# EAGLE design IPSv1.0 (EAGLE 9.5.0)
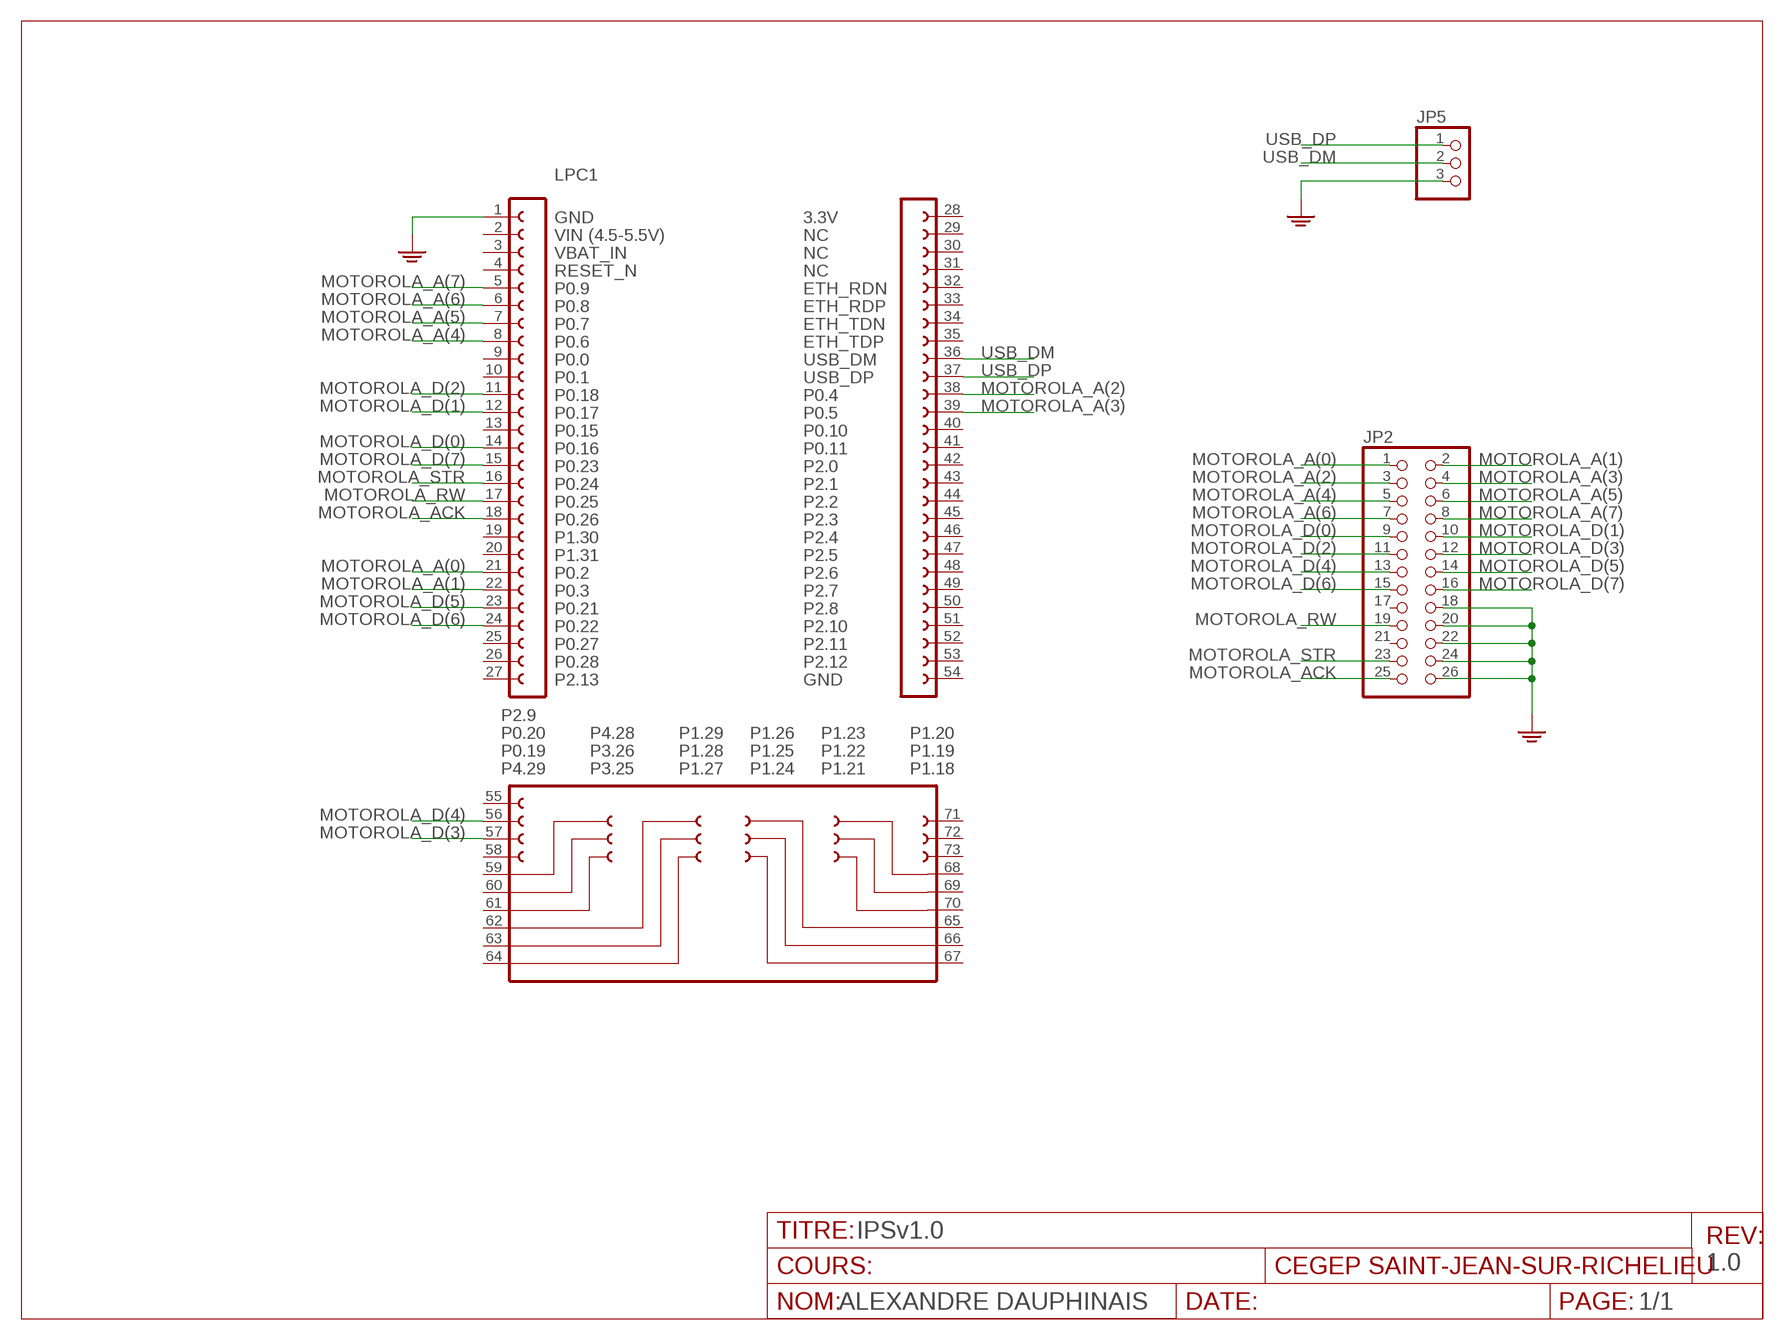
[diagram p0: schematic, sheet 1]

## Parts
JP2  PINHD-2X13  [2X13]
JP5  PINHD-1X3  [1X03]
LPC1  LPCXPRESSO_LPC1769  [LPCXPRESSO_LPC1769]

## Nets
GND: JP2.18 JP2.20 JP2.22 JP2.24 JP2.26 JP5.3 LPC1.1
MOTOROLA_A(0): JP2.1 LPC1.21
MOTOROLA_A(1): JP2.2 LPC1.22
MOTOROLA_A(2): JP2.3 LPC1.38
MOTOROLA_A(3): JP2.4 LPC1.39
MOTOROLA_A(4): JP2.5 LPC1.8
MOTOROLA_A(5): JP2.6 LPC1.7
MOTOROLA_A(6): JP2.7 LPC1.6
MOTOROLA_A(7): JP2.8 LPC1.5
MOTOROLA_ACK: JP2.25 LPC1.18
MOTOROLA_D(0): JP2.9 LPC1.14
MOTOROLA_D(1): JP2.10 LPC1.12
MOTOROLA_D(2): JP2.11 LPC1.11
MOTOROLA_D(3): JP2.12 LPC1.57
MOTOROLA_D(4): JP2.13 LPC1.56
MOTOROLA_D(5): JP2.14 LPC1.23
MOTOROLA_D(6): JP2.15 LPC1.24
MOTOROLA_D(7): JP2.16 LPC1.15
MOTOROLA_RW: JP2.19 LPC1.17
MOTOROLA_STR: JP2.23 LPC1.16
USB_DM: JP5.2 LPC1.36
USB_DP: JP5.1 LPC1.37
Unconnected: JP2.17 JP2.21 LPC1.2 LPC1.3 LPC1.4 LPC1.9 LPC1.10 LPC1.13 LPC1.19 LPC1.20 LPC1.25 LPC1.26 LPC1.27 LPC1.28 LPC1.29 LPC1.30 LPC1.31 LPC1.32 LPC1.33 LPC1.34 LPC1.35 LPC1.40 LPC1.41 LPC1.42 LPC1.43 LPC1.44 LPC1.45 LPC1.46 LPC1.47 LPC1.48 LPC1.49 LPC1.50 LPC1.51 LPC1.52 LPC1.53 LPC1.54 LPC1.55 LPC1.58 LPC1.59 LPC1.60 LPC1.61 LPC1.62 LPC1.63 LPC1.64 LPC1.65 LPC1.66 LPC1.67 LPC1.68 LPC1.69 LPC1.70 LPC1.71 LPC1.72 LPC1.73

## Library data of the parts
JP2 = pinhead:PINHD-2X13: PIN HEADER
JP5 = pinhead:PINHD-1X3: PIN HEADER
LPC1 = LPCXpresso_boards:LPCXPRESSO_LPC1769

## Board
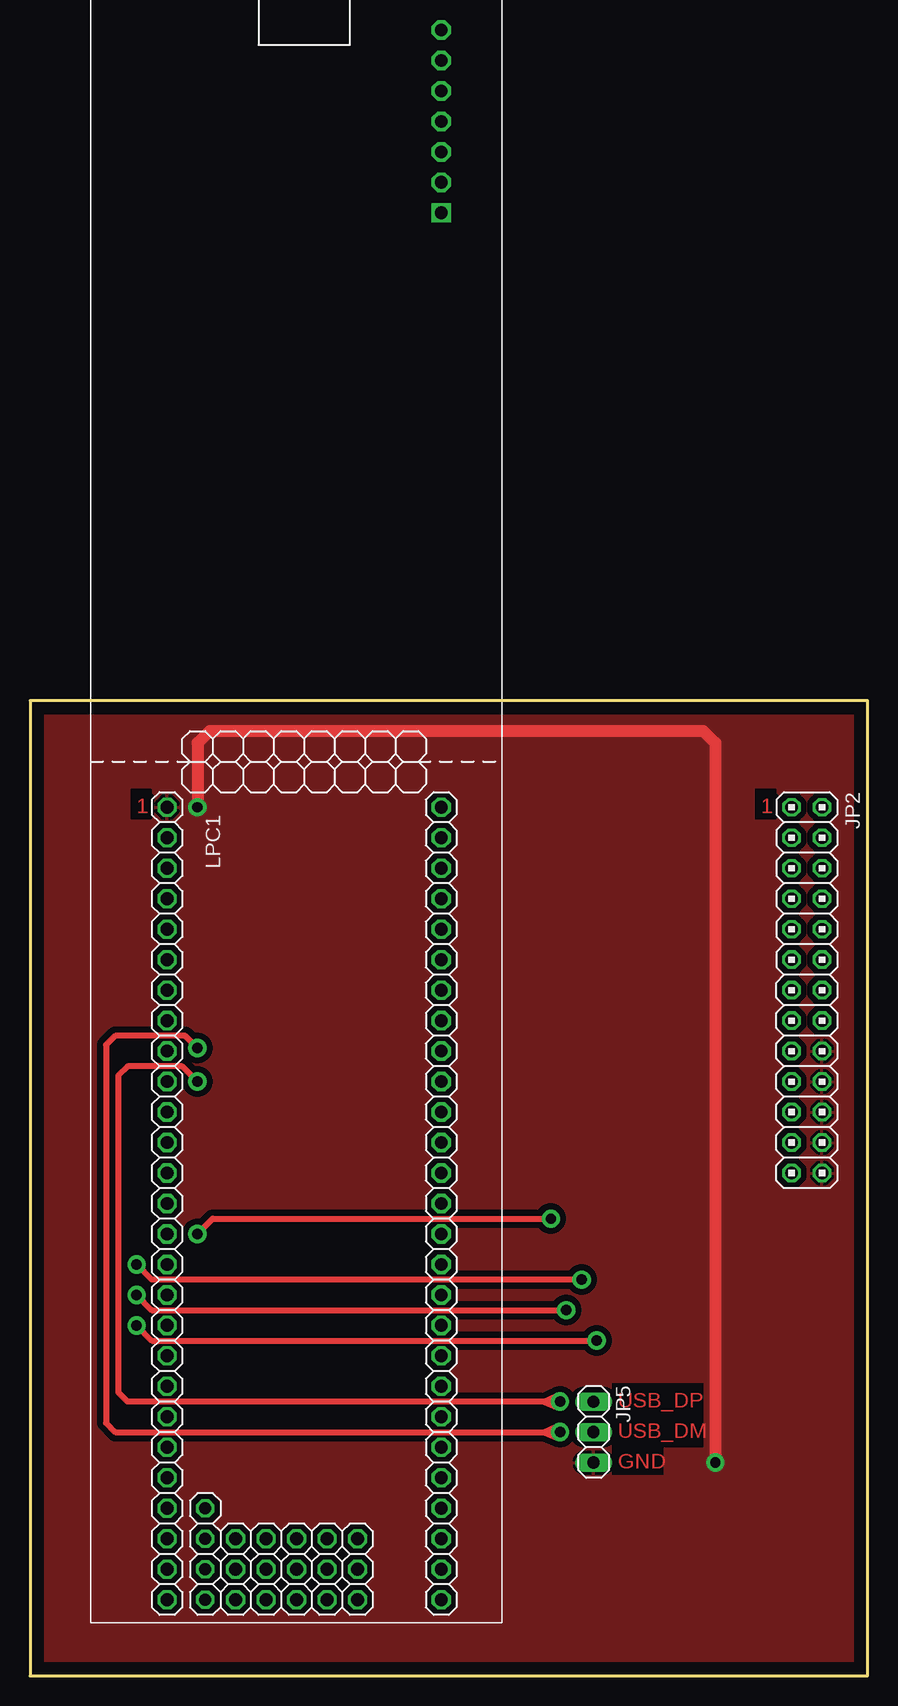
[diagram p1: board, top side]
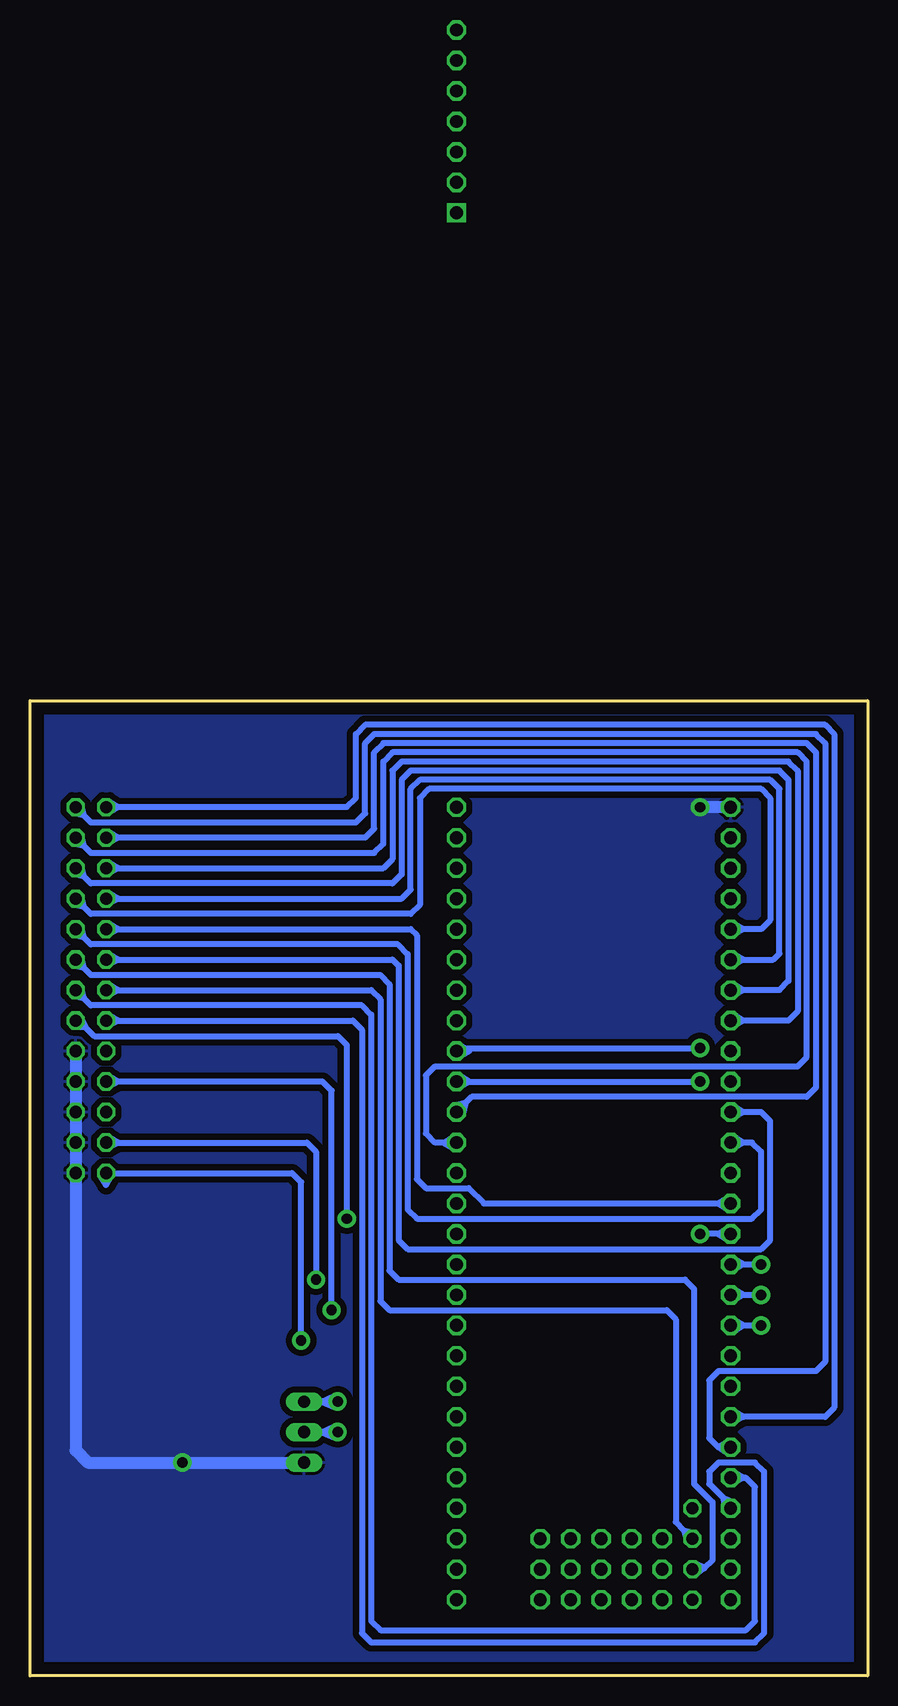
[diagram p2: board, bottom side, seen from below]

Size 69.85 x 81.28 mm. Coordinates in mm from the lower left corner, seen from the top.
Outline: 0,0 69.85,0 69.85,81.28 0,81.28 0,0
Copper layers (1*16): Top 0.035mm / dielectric 1.5mm / Bottom 0.035mm
Design rules "DRCmasse": minimum track width 20mil, minimum drill 1mil, track to track 20mil, track to pad 50mil, pad to pad 10mil, via to via 10mil, smd to smd 8mil, copper to edge 40mil, drill to drill 8mil, minimum pad ring 10mil, minimum via ring 8mil, stop-mask expansion 0mil, vias tented up to drill 0mil, thermal gap 10mil
tRestrict: area 48.5,19 to 56.1,24.4; area 48.5,16.8 to 52.8,19.1; area 8.4,71.4 to 10.2,73.9; area 60.5,71.4 to 62.2,73.9

### Footprints (pad centres in the part's own frame; a part is rotated, then mirrored left to right if it is on the bottom)
2X13 = drill 1.016 octagon: 1 -15.24,-1.27; 2 -15.24,1.27; 3 -12.7,-1.27; 4 -12.7,1.27; 5 -10.16,-1.27; 6 -10.16,1.27; 7 -7.62,-1.27; 8 -7.62,1.27; 9 -5.08,-1.27; 10 -5.08,1.27; 11 -2.54,-1.27; 12 -2.54,1.27; 13 0,-1.27; 14 0,1.27; 15 2.54,-1.27; 16 2.54,1.27; 17 5.08,-1.27; 18 5.08,1.27; 19 7.62,-1.27; 20 7.62,1.27; 21 10.16,-1.27; 22 10.16,1.27; 23 12.7,-1.27; 24 12.7,1.27; 25 15.24,-1.27; 26 15.24,1.27
1X03 = drill 1.016 long: 1 -2.54,0; 2 0,0; 3 2.54,0
LPCXPRESSO_LPC1769 = drill 1.067 octagon: 1 33.655,-5.715; 2 36.195,-5.715; 3 38.735,-5.715; 4 41.275,-5.715; 5 43.815,-5.715; 6 46.355,-5.715; 7 48.895,-5.715; 8 51.435,-5.715; 9 53.975,-5.715; 10 56.515,-5.715; 11 59.055,-5.715; 12 61.595,-5.715; 13 64.135,-5.715; 14 66.675,-5.715; 15 69.215,-5.715; 16 71.755,-5.715; 17 74.295,-5.715; 18 76.835,-5.715; 19 79.375,-5.715; 20 81.915,-5.715; 21 84.455,-5.715; 22 86.995,-5.715; 23 89.535,-5.715; 24 92.075,-5.715; 25 94.615,-5.715; 26 97.155,-5.715; 27 99.695,-5.715; 28 33.655,17.145; 29 36.195,17.145; 30 38.735,17.145; 31 41.275,17.145; 32 43.815,17.145; 33 46.355,17.145; 34 48.895,17.145; 35 51.435,17.145; 36 53.975,17.145; 37 56.515,17.145; 38 59.055,17.145; 39 61.595,17.145; 40 64.135,17.145; 41 66.675,17.145; 42 69.215,17.145; 43 71.755,17.145; 44 74.295,17.145; 45 76.835,17.145; 46 79.375,17.145; 47 81.915,17.145; 48 84.455,17.145; 49 86.995,17.145; 50 89.535,17.145; 51 92.075,17.145; 52 94.615,17.145; 53 97.155,17.145; 54 99.695,17.145; 59 94.615,0; 60 97.155,0; 61 99.695,0; 62 94.615,2.54; 63 97.155,2.54; 64 99.695,2.54; 65 94.615,5.08; 66 97.155,5.08; 67 99.695,5.08; 68 94.615,7.62; 69 97.155,7.62; 70 99.695,7.62; 71 94.615,10.16; 72 97.155,10.16; 73 99.695,10.16; P$1 -31.115,17.145; P$2 -28.575,17.145; P$3 -26.035,17.145; P$4 -23.495,17.145; P$5 -20.955,17.145; P$6 -18.415,17.145 | drill 1 octagon: 55 92.075,-2.54; 56 94.615,-2.54; 57 97.155,-2.54; 58 99.695,-2.54 | drill 1.067 square: P$7 -15.875,17.145

### Placement (x,y rotation side)
JP2  64.77,57.15 270 top
JP5  46.99,20.32 270 top
LPC1  17.14,106.05 270 top

### Tracks (layer width: path | path; a pad name or v marks a point on that pad's centre or on a via)
GND  (via drill 0.86 pad 1.52)
  Top 1.016: v57.15,17.78 57.15,77.72 56.13,78.74 14.99,78.74 13.97,77.72 v13.97,72.39
  Bottom 1.016: JP2.18 JP2.20 JP2.22 JP2.24 JP2.26 66.04,18.8 65.02,17.78 v57.15,17.78 JP5.3 | LPC1.1 v13.97,72.39
  pour Top: 0,0 69.85,0 69.85,81.28 0,81.28
  pour Bottom: 0,0 69.85,0 69.85,81.28 0,81.28
MOTOROLA_A(0)
  Bottom 0.508: 62.48,72.39 43.43,72.39 42.67,73.15 42.67,78.49 41.91,79.25 3.56,79.25 2.79,78.49 2.79,22.35 3.56,21.59 10.36,21.59 | 62.48,72.39 JP2.1 | 10.36,21.59 | 10.36,21.59 LPC1.21 | 62.48,72.39 | 62.48,72.39 63.25,71.95 | JP2.1 63.25,71.95 | 62.48,72.39 | 62.48,72.39 63.25,72.83 | JP2.1 63.25,72.83 | 62.48,72.39 63.25,71.95 | 63.25,71.95 | JP2.1 63.25,71.95 | 62.48,72.39 63.25,72.83 | JP2.1 63.25,72.83 | 62.48,72.39 63.25,71.95 | JP2.1 63.25,71.95 | 62.48,72.39 63.25,72.83 | JP2.1 63.25,72.83 | 10.36,21.59 | 10.36,21.59 11.15,21.12 | LPC1.21 11.15,21.12 | 10.36,21.59 11.15,22.06 | LPC1.21 11.15,22.06 | 10.36,21.59 11.15,21.12 | 10.36,21.59 11.15,22.06 | 10.36,21.59 11.15,21.12 | LPC1.21 11.15,21.12 | 10.36,21.59 11.15,22.06 | LPC1.21 11.15,22.06
MOTOROLA_A(1)
  Bottom 0.508: JP2.2 65.32,71.67 | 65.32,71.67 64.77,71.12 42.67,71.12 41.91,71.88 41.91,77.72 41.15,78.49 4.32,78.49 3.56,77.72 3.56,26.16 4.32,25.4 12.45,25.4 13.21,24.64 13.21,19.81 12.5,19.1 | LPC1.22 12.45,19.05 12.5,19.1 | 12.5,19.1 11.69,19.53 LPC1.22 | 12.5,19.1 11.73,18.59 LPC1.22 | 65.32,71.67 66.17,71.9 JP2.2 | 65.32,71.67 65.55,72.52 JP2.2
MOTOROLA_A(2)
  Bottom 0.508: JP2.3 62.48,69.85 | 33.54,47.74 33.02,48.26 5.08,48.26 4.32,49.02 4.32,76.96 5.08,77.72 40.39,77.72 41.15,76.96 41.15,70.61 41.91,69.85 62.48,69.85 | 33.54,47.74 | 33.54,47.74 LPC1.38 | 62.48,69.85 | 62.48,69.85 63.25,69.41 | JP2.3 63.25,69.41 | 62.48,69.85 | 62.48,69.85 63.25,70.29 | JP2.3 63.25,70.29 | 62.48,69.85 63.25,69.41 | 63.25,69.41 | JP2.3 63.25,69.41 | 62.48,69.85 63.25,70.29 | JP2.3 63.25,70.29 | 62.48,69.85 63.25,69.41 | JP2.3 63.25,69.41 | 62.48,69.85 63.25,70.29 | JP2.3 63.25,70.29 | 33.54,47.74 | 33.54,47.74 33.76,46.86 | 33.76,46.86 | 33.54,47.74 34.42,47.52 | 34.42,47.52 | 33.54,47.74 33.76,46.86 | 33.76,46.86 | LPC1.38 33.76,46.86 | 33.54,47.74 | 33.54,47.74 34.42,47.52 | LPC1.38 34.42,47.52 | 33.54,47.74 33.76,46.86 | LPC1.38 33.76,46.86 | 33.54,47.74 34.42,47.52 | LPC1.38 34.42,47.52
MOTOROLA_A(3)
  Bottom 0.508: JP2.4 65.32,69.13 | 65.32,69.13 64.77,68.58 41.15,68.58 40.39,69.34 40.39,76.2 39.62,76.96 5.84,76.96 5.08,76.2 5.08,51.56 5.84,50.8 36.07,50.8 36.83,50.04 36.83,45.21 36.07,44.45 35.36,44.45 | LPC1.39 35.36,44.45 | 35.36,44.45 | 35.36,44.45 34.57,44.92 | LPC1.39 34.57,44.92 | 35.36,44.45 | 35.36,44.45 34.57,43.98 | LPC1.39 34.57,43.98 | 35.36,44.45 34.57,44.92 | 35.36,44.45 34.57,43.98 | 35.36,44.45 34.57,44.92 | LPC1.39 34.57,44.92 | 35.36,44.45 34.57,43.98 | LPC1.39 34.57,43.98 | 65.32,69.13 66.17,69.36 JP2.4 | 65.32,69.13 65.55,69.98 JP2.4
MOTOROLA_A(4)
  Bottom 0.508: JP2.5 62.48,67.31 | 10.36,54.61 6.6,54.61 5.84,55.37 5.84,75.44 6.6,76.2 38.86,76.2 39.62,75.44 39.62,68.07 40.39,67.31 62.48,67.31 | 10.36,54.61 | 10.36,54.61 LPC1.8 | 62.48,67.31 | 62.48,67.31 63.25,66.87 | JP2.5 63.25,66.87 | 62.48,67.31 | 62.48,67.31 63.25,67.75 | JP2.5 63.25,67.75 | 62.48,67.31 63.25,66.87 | 63.25,66.87 | JP2.5 63.25,66.87 | 62.48,67.31 63.25,67.75 | JP2.5 63.25,67.75 | 62.48,67.31 63.25,66.87 | JP2.5 63.25,66.87 | 62.48,67.31 63.25,67.75 | JP2.5 63.25,67.75 | 10.36,54.61 | 10.36,54.61 11.15,54.14 | LPC1.8 11.15,54.14 | 10.36,54.61 11.15,55.08 | LPC1.8 11.15,55.08 | 10.36,54.61 11.15,54.14 | 10.36,54.61 11.15,55.08 | 10.36,54.61 11.15,54.14 | LPC1.8 11.15,54.14 | 10.36,54.61 11.15,55.08 | LPC1.8 11.15,55.08
MOTOROLA_A(5)
  Bottom 0.508: JP2.6 65.32,66.59 | 65.32,66.59 64.77,66.04 39.62,66.04 38.86,66.8 38.86,74.68 38.1,75.44 7.37,75.44 6.6,74.68 6.6,57.91 7.37,57.15 10.36,57.15 | 10.36,57.15 | 10.36,57.15 LPC1.7 | 65.32,66.59 66.17,66.82 JP2.6 | 65.32,66.59 65.55,67.44 JP2.6 | 10.36,57.15 | 10.36,57.15 11.15,56.68 | LPC1.7 11.15,56.68 | 10.36,57.15 11.15,57.62 | LPC1.7 11.15,57.62 | 10.36,57.15 11.15,56.68 | 10.36,57.15 11.15,57.62 | 10.36,57.15 11.15,56.68 | LPC1.7 11.15,56.68 | 10.36,57.15 11.15,57.62 | LPC1.7 11.15,57.62
MOTOROLA_A(6)
  Bottom 0.508: JP2.7 62.48,64.77 | LPC1.6 10.36,59.69 | 10.36,59.69 | 10.36,59.69 7.87,59.69 7.37,60.2 7.37,73.91 8.13,74.68 37.34,74.68 38.1,73.91 38.1,65.53 38.86,64.77 62.48,64.77 | 62.48,64.77 | 62.48,64.77 63.25,64.33 | JP2.7 63.25,64.33 | 62.48,64.77 | 62.48,64.77 63.25,65.21 | JP2.7 63.25,65.21 | 62.48,64.77 63.25,64.33 | 63.25,64.33 | JP2.7 63.25,64.33 | 62.48,64.77 63.25,65.21 | JP2.7 63.25,65.21 | 62.48,64.77 63.25,64.33 | JP2.7 63.25,64.33 | 62.48,64.77 63.25,65.21 | JP2.7 63.25,65.21 | 10.36,59.69 | 10.36,59.69 11.15,59.22 | LPC1.6 11.15,59.22 | 10.36,59.69 11.15,60.16 | LPC1.6 11.15,60.16 | 10.36,59.69 11.15,59.22 | 10.36,59.69 11.15,60.16 | 10.36,59.69 11.15,59.22 | LPC1.6 11.15,59.22 | 10.36,59.69 11.15,60.16 | LPC1.6 11.15,60.16
MOTOROLA_A(7)
  Bottom 0.508: JP2.8 65.32,64.05 | 65.32,64.05 64.77,63.5 38.1,63.5 37.34,64.26 37.34,73.15 36.58,73.91 8.89,73.91 8.13,73.15 8.13,62.99 8.89,62.23 10.36,62.23 | 10.36,62.23 | 10.36,62.23 LPC1.5 | 65.32,64.05 66.17,64.28 JP2.8 | 65.32,64.05 65.55,64.9 JP2.8 | 10.36,62.23 | 10.36,62.23 11.15,61.76 | LPC1.5 11.15,61.76 | 10.36,62.23 11.15,62.7 | LPC1.5 11.15,62.7 | 10.36,62.23 11.15,61.76 | 10.36,62.23 11.15,62.7 | 10.36,62.23 11.15,61.76 | LPC1.5 11.15,61.76 | 10.36,62.23 11.15,62.7 | LPC1.5 11.15,62.7
MOTOROLA_ACK  (via drill 0.86 pad 1.52)
  Top 0.508: v8.89,29.21 10.16,27.94 v47.24,27.94
  Bottom 0.508: LPC1.18 10.36,29.21 | 10.36,29.21 | v47.24,27.94 47.24,41.15 48.01,41.91 JP2.25 | JP2.25 63.5,40.89 | 63.5,40.89 | 63.5,40.89 63.94,41.66 | JP2.25 63.94,41.66 | 63.5,40.89 | 63.5,40.89 63.06,41.66 | JP2.25 63.06,41.66 | 63.5,40.89 63.94,41.66 | 63.94,41.66 | JP2.25 63.94,41.66 | 63.5,40.89 63.06,41.66 | JP2.25 63.06,41.66 | 63.5,40.89 63.94,41.66 | JP2.25 63.94,41.66 | 63.5,40.89 63.06,41.66 | JP2.25 63.06,41.66 | 10.36,29.21 | 10.36,29.21 11.15,28.74 | LPC1.18 11.15,28.74 | 10.36,29.21 11.15,29.68 | LPC1.18 11.15,29.68 | 10.36,29.21 11.15,28.74 | 10.36,29.21 11.15,29.68 | 11.15,28.74 10.36,29.21 | LPC1.18 11.15,28.74 | 10.36,29.21 11.15,29.68 | LPC1.18 11.15,29.68 | 10.36,29.21 v8.89,29.21
MOTOROLA_D(0)
  Bottom 0.508: JP2.9 62.48,62.23 | 12.5,39.37 32,39.37 33.27,40.64 36.83,40.64 37.59,41.4 37.59,61.72 38.1,62.23 62.48,62.23 | 12.5,39.37 | 12.5,39.37 LPC1.14 | 62.48,62.23 | 62.48,62.23 63.25,61.79 | JP2.9 63.25,61.79 | 62.48,62.23 | 62.48,62.23 63.25,62.67 | JP2.9 63.25,62.67 | 62.48,62.23 63.25,61.79 | 63.25,61.79 | JP2.9 63.25,61.79 | 62.48,62.23 63.25,62.67 | JP2.9 63.25,62.67 | 62.48,62.23 63.25,61.79 | JP2.9 63.25,61.79 | 62.48,62.23 63.25,62.67 | JP2.9 63.25,62.67 | 12.5,39.37 11.71,39.84 | LPC1.14 11.71,39.84 | 12.5,39.37 | 12.5,39.37 11.71,38.9 | LPC1.14 11.71,38.9 | 12.5,39.37 11.71,39.84 | 12.5,39.37 11.71,38.9 | 12.5,39.37 11.71,39.84 | LPC1.14 11.71,39.84 | 12.5,39.37 11.71,38.9 | LPC1.14 11.71,38.9
MOTOROLA_D(1)
  Bottom 0.508: JP2.10 65.32,61.51 | 65.32,61.51 64.77,60.96 39.17,60.96 38.35,60.15 38.35,38.86 37.59,38.1 9.65,38.1 8.89,38.86 8.89,43.69 9.65,44.45 10.36,44.45 | 10.36,44.45 | 10.36,44.45 LPC1.12 | 65.32,61.51 66.17,61.74 JP2.10 | 65.32,61.51 65.55,62.36 JP2.10 | 10.36,44.45 | 10.36,44.45 11.15,43.98 | LPC1.12 11.15,43.98 | 10.36,44.45 11.15,44.92 | LPC1.12 11.15,44.92 | 10.36,44.45 11.15,43.98 | 10.36,44.45 11.15,44.92 | 10.36,44.45 11.15,43.98 | LPC1.12 11.15,43.98 | 10.36,44.45 11.15,44.92 | LPC1.12 11.15,44.92
MOTOROLA_D(2)
  Bottom 0.508: JP2.11 62.48,59.69 | 10.36,46.99 8.89,46.99 8.13,46.23 8.13,36.32 8.89,35.56 38.35,35.56 39.12,36.32 39.12,59.18 39.62,59.69 62.48,59.69 | 10.36,46.99 | 10.36,46.99 LPC1.11 | 62.48,59.69 | 62.48,59.69 63.25,59.25 | JP2.11 63.25,59.25 | 62.48,59.69 | 62.48,59.69 63.25,60.13 | JP2.11 63.25,60.13 | 62.48,59.69 63.25,59.25 | 63.25,59.25 | JP2.11 63.25,59.25 | 62.48,59.69 63.25,60.13 | JP2.11 63.25,60.13 | 62.48,59.69 63.25,59.25 | JP2.11 63.25,59.25 | 62.48,59.69 63.25,60.13 | JP2.11 63.25,60.13 | 10.36,46.99 | 10.36,46.99 11.15,46.52 | LPC1.11 11.15,46.52 | 10.36,46.99 11.15,47.46 | LPC1.11 11.15,47.46 | 10.36,46.99 11.15,46.52 | 10.36,46.99 11.15,47.46 | 10.36,46.99 11.15,46.52 | LPC1.11 11.15,46.52 | 10.36,46.99 11.15,47.46 | LPC1.11 11.15,47.46
MOTOROLA_D(3)
  Bottom 0.508: JP2.12 65.32,58.97 | 65.32,58.97 64.77,58.42 40.64,58.42 39.88,57.66 39.88,33.78 39.12,33.02 15.24,33.02 14.48,32.26 14.48,16 12.95,14.48 12.95,9.65 13.61,8.99 | 13.61,8.99 13.72,8.89 LPC1.57 | 65.32,58.97 66.17,59.2 JP2.12 | 65.32,58.97 65.55,59.82 JP2.12 | 13.61,8.99 14.31,8.49 LPC1.57 | 13.61,8.99 14.4,9.35 LPC1.57
MOTOROLA_D(4)
  Bottom 0.508: JP2.13 62.48,57.15 | 15.31,12.14 16,12.83 16,29.72 16.76,30.48 39.88,30.48 40.64,31.24 40.64,56.39 41.4,57.15 62.48,57.15 | 15.31,12.14 | 15.31,12.14 LPC1.56 | 62.48,57.15 | 62.48,57.15 63.25,56.71 | JP2.13 63.25,56.71 | 62.48,57.15 | 62.48,57.15 63.25,57.59 | JP2.13 63.25,57.59 | 62.48,57.15 63.25,56.71 | 63.25,56.71 | JP2.13 63.25,56.71 | 62.48,57.15 63.25,57.59 | JP2.13 63.25,57.59 | 62.48,57.15 63.25,56.71 | JP2.13 63.25,56.71 | 62.48,57.15 63.25,57.59 | JP2.13 63.25,57.59 | 15.31,12.14 14.48,11.91 | 15.31,12.14 15.09,11.3 | 14.48,11.91 | LPC1.56 14.48,11.91 | 15.31,12.14 15.09,11.3 | LPC1.56 15.09,11.3 | 15.31,12.14 14.48,11.91 | LPC1.56 14.48,11.91 | 15.31,12.14 15.09,11.3 | LPC1.56 15.09,11.3
MOTOROLA_D(5)
  Bottom 0.508: JP2.14 65.32,56.43 | 65.32,56.43 64.77,55.88 42.16,55.88 41.4,55.12 41.4,4.57 40.64,3.81 10.16,3.81 9.4,4.57 9.4,15.75 10.16,16.51 10.36,16.51 | 10.36,16.51 | 10.36,16.51 LPC1.23 | 65.32,56.43 66.17,56.66 JP2.14 | 65.32,56.43 65.55,57.28 JP2.14 | 10.36,16.51 | 10.36,16.51 11.15,16.04 | LPC1.23 11.15,16.04 | 10.36,16.51 11.15,16.98 | LPC1.23 11.15,16.98 | 10.36,16.51 11.15,16.04 | 10.36,16.51 11.15,16.98 | 10.36,16.51 11.15,16.04 | LPC1.23 11.15,16.04 | 10.36,16.51 11.15,16.98 | LPC1.23 11.15,16.98
MOTOROLA_D(6)
  Bottom 0.508: JP2.15 62.48,54.61 | LPC1.24 11.43,14.22 12.05,14.84 | 12.05,14.84 13.21,16 13.21,17.02 12.45,17.78 9.4,17.78 8.64,17.02 8.64,3.56 9.4,2.79 41.4,2.79 42.16,3.56 42.16,53.85 42.93,54.61 62.48,54.61 | 62.48,54.61 | 62.48,54.61 63.25,54.17 | JP2.15 63.25,54.17 | 62.48,54.61 | 62.48,54.61 63.25,55.05 | JP2.15 63.25,55.05 | 62.48,54.61 63.25,54.17 | 63.25,54.17 | JP2.15 63.25,54.17 | 62.48,54.61 63.25,55.05 | JP2.15 63.25,55.05 | 62.48,54.61 63.25,54.17 | JP2.15 63.25,54.17 | 62.48,54.61 63.25,55.05 | JP2.15 63.25,55.05 | 12.05,14.84 11.21,14.47 LPC1.24 | 12.05,14.84 11.97,13.93 LPC1.24
MOTOROLA_D(7)  (via drill 0.86 pad 1.52)
  Top 0.508: v13.97,36.83 15.24,38.1 v43.43,38.1
  Bottom 0.508: JP2.16 65.79,54.61 65.21,54.03 | 65.21,54.03 64.49,53.31 44.17,53.31 43.43,52.58 v43.43,38.1 | 12.5,36.83 | 12.5,36.83 LPC1.15 | 65.21,54.03 66.08,54.1 JP2.16 | 65.21,54.03 65.58,54.83 JP2.16 | 12.5,36.83 11.71,37.3 | LPC1.15 11.71,37.3 | 12.5,36.83 | 12.5,36.83 11.71,36.36 | LPC1.15 11.71,36.36 | 12.5,36.83 11.71,37.3 | 12.5,36.83 11.71,36.36 | 12.5,36.83 11.71,37.3 | LPC1.15 11.71,37.3 | 12.5,36.83 11.71,36.36 | LPC1.15 11.71,36.36 | 12.5,36.83 v13.97,36.83
MOTOROLA_RW  (via drill 0.86 pad 1.52)
  Top 0.508: v8.89,31.75 10.16,30.48 v44.7,30.48
  Bottom 0.508: 62.48,49.53 45.47,49.53 44.7,48.77 v44.7,30.48 | 62.48,49.53 JP2.19 | LPC1.17 10.36,31.75 | 10.36,31.75 | 62.48,49.53 | 62.48,49.53 63.25,49.09 | JP2.19 63.25,49.09 | 62.48,49.53 | 62.48,49.53 63.25,49.97 | JP2.19 63.25,49.97 | 62.48,49.53 63.25,49.09 | 63.25,49.09 | JP2.19 63.25,49.09 | 62.48,49.53 63.25,49.97 | JP2.19 63.25,49.97 | 62.48,49.53 63.25,49.09 | JP2.19 63.25,49.09 | 62.48,49.53 63.25,49.97 | JP2.19 63.25,49.97 | 10.36,31.75 | 10.36,31.75 11.15,31.28 | LPC1.17 11.15,31.28 | 10.36,31.75 11.15,32.22 | LPC1.17 11.15,32.22 | 10.36,31.75 11.15,31.28 | 10.36,31.75 11.15,32.22 | 10.36,31.75 11.15,31.28 | LPC1.17 11.15,31.28 | 10.36,31.75 11.15,32.22 | LPC1.17 11.15,32.22 | 10.36,31.75 v8.89,31.75
MOTOROLA_STR  (via drill 0.86 pad 1.52)
  Top 0.508: v8.89,34.29 10.16,33.02 v46,33.02
  Bottom 0.508: 62.48,44.45 JP2.23 | LPC1.16 10.36,34.29 | 10.36,34.29 | 62.48,44.45 | 62.48,44.45 63.25,44.01 | JP2.23 63.25,44.01 | 62.48,44.45 | 62.48,44.45 63.25,44.89 | JP2.23 63.25,44.89 | 62.48,44.45 63.25,44.01 | 63.25,44.01 | JP2.23 63.25,44.01 | 62.48,44.45 63.25,44.89 | JP2.23 63.25,44.89 | 62.48,44.45 63.25,44.01 | JP2.23 63.25,44.01 | 62.48,44.45 63.25,44.89 | JP2.23 63.25,44.89 | 10.36,34.29 | 10.36,34.29 11.15,33.82 | LPC1.16 11.15,33.82 | 10.36,34.29 11.15,34.76 | LPC1.16 11.15,34.76 | 10.36,34.29 11.15,33.82 | 10.36,34.29 11.15,34.76 | 10.36,34.29 11.15,33.82 | LPC1.16 11.15,33.82 | 10.36,34.29 11.15,34.76 | LPC1.16 11.15,34.76 | 62.48,44.45 46.76,44.45 46,43.69 v46,33.02 | 10.36,34.29 v8.89,34.29
USB_DM  (via drill 0.86 pad 1.52)
  Top 0.508: 42.9,20.32 7.11,20.32 6.35,21.08 6.35,52.58 7.11,53.34 12.95,53.34 v13.97,52.32 | 42.9,20.32 v44.2,20.32 | 42.9,20.32 44,19.85 | v44.2,20.32 44,19.85 | 42.9,20.32 44,20.79 | v44.2,20.32 44,20.79 | 42.9,20.32 44,19.85 | 44,19.85 | v44.2,20.32 44,19.85 | 42.9,20.32 44,20.79 | v44.2,20.32 44,20.79 | 42.9,20.32 44,19.85 | v44.2,20.32 44,19.85 | 42.9,20.32 44,20.79 | v44.2,20.32 44,20.79
  Bottom 0.508: LPC1.36 33.22,52.07 | 33.22,52.07 | v44.2,20.32 45.49,20.32 | 45.49,20.32 JP5.2 | 45.49,20.32 44.4,20.79 | v44.2,20.32 44.4,20.79 | 45.49,20.32 44.4,19.85 | v44.2,20.32 44.4,19.85 | 45.49,20.32 44.4,20.79 | 44.4,20.79 | v44.2,20.32 44.4,20.79 | 45.49,20.32 44.4,19.85 | v44.2,20.32 44.4,19.85 | 45.49,20.32 44.4,20.79 | v44.2,20.32 44.4,20.79 | 45.49,20.32 44.4,19.85 | v44.2,20.32 44.4,19.85 | 33.22,52.07 | 33.22,52.07 34.01,51.6 | LPC1.36 34.01,51.6 | 33.22,52.07 33.65,52.32 | 33.65,52.32 34.01,52.54 | LPC1.36 34.01,52.54 | 33.22,52.07 34.01,51.6 | 33.22,52.07 34.01,52.54 | 33.22,52.07 34.01,51.6 | LPC1.36 34.01,51.6 | 33.22,52.07 34.01,52.54 | LPC1.36 34.01,52.54 | 33.65,52.32 v13.97,52.32
USB_DP  (via drill 0.86 pad 1.52)
  Top 0.508: v44.2,22.86 42.9,22.86 | 42.9,22.86 8.13,22.86 7.37,23.62 7.37,50.04 8.13,50.8 12.7,50.8 v13.97,49.53 | 42.9,22.86 44,22.39 | v44.2,22.86 44,22.39 | 42.9,22.86 44,23.33 | v44.2,22.86 44,23.33 | 42.9,22.86 44,22.39 | 44,22.39 | v44.2,22.86 44,22.39 | 42.9,22.86 44,23.33 | v44.2,22.86 44,23.33 | 42.9,22.86 44,22.39 | v44.2,22.86 44,22.39 | 42.9,22.86 44,23.33 | v44.2,22.86 44,23.33
  Bottom 0.508: LPC1.37 33.22,49.53 | 33.22,49.53 | v44.2,22.86 45.49,22.86 | 45.49,22.86 JP5.1 | 45.49,22.86 44.4,23.33 | v44.2,22.86 44.4,23.33 | 45.49,22.86 44.4,22.39 | v44.2,22.86 44.4,22.39 | 45.49,22.86 44.4,23.33 | 44.4,23.33 | v44.2,22.86 44.4,23.33 | 45.49,22.86 44.4,22.39 | v44.2,22.86 44.4,22.39 | 45.49,22.86 44.4,23.33 | v44.2,22.86 44.4,23.33 | 45.49,22.86 44.4,22.39 | v44.2,22.86 44.4,22.39 | 33.22,49.53 | 33.22,49.53 34.01,49.06 | LPC1.37 34.01,49.06 | 33.22,49.53 34.01,50 | LPC1.37 34.01,50 | 33.22,49.53 34.01,49.06 | 33.22,49.53 34.01,50 | 33.22,49.53 34.01,49.06 | LPC1.37 34.01,49.06 | 33.22,49.53 34.01,50 | LPC1.37 34.01,50 | 33.22,49.53 v13.97,49.53

### Text on the board
Top: 1 | 1 | USB_DP | USB_DM | GND